# EAGLE board FV1 DSP pedal (EAGLE 9.3.0)
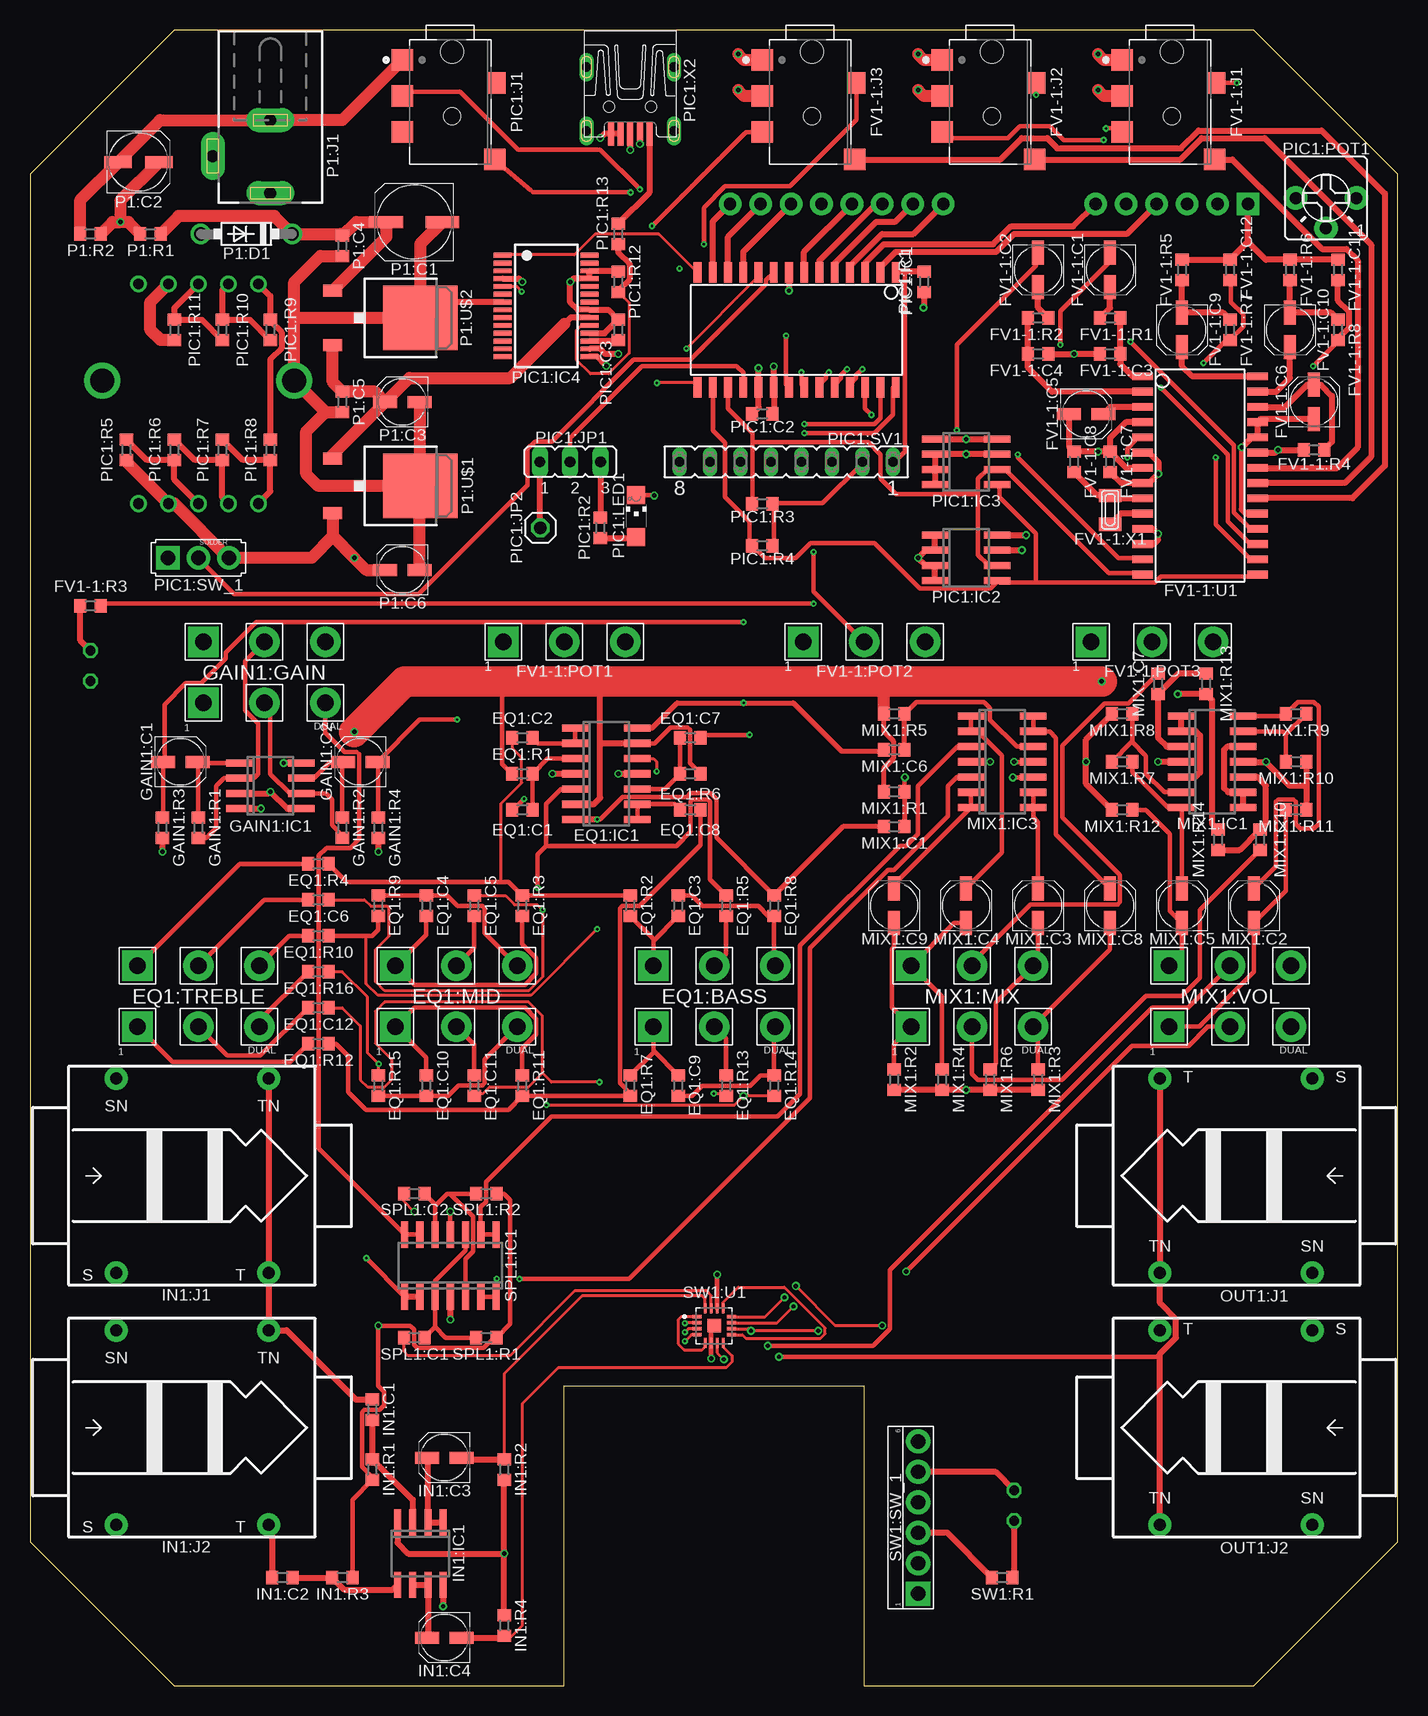
[diagram p11: board, top side]
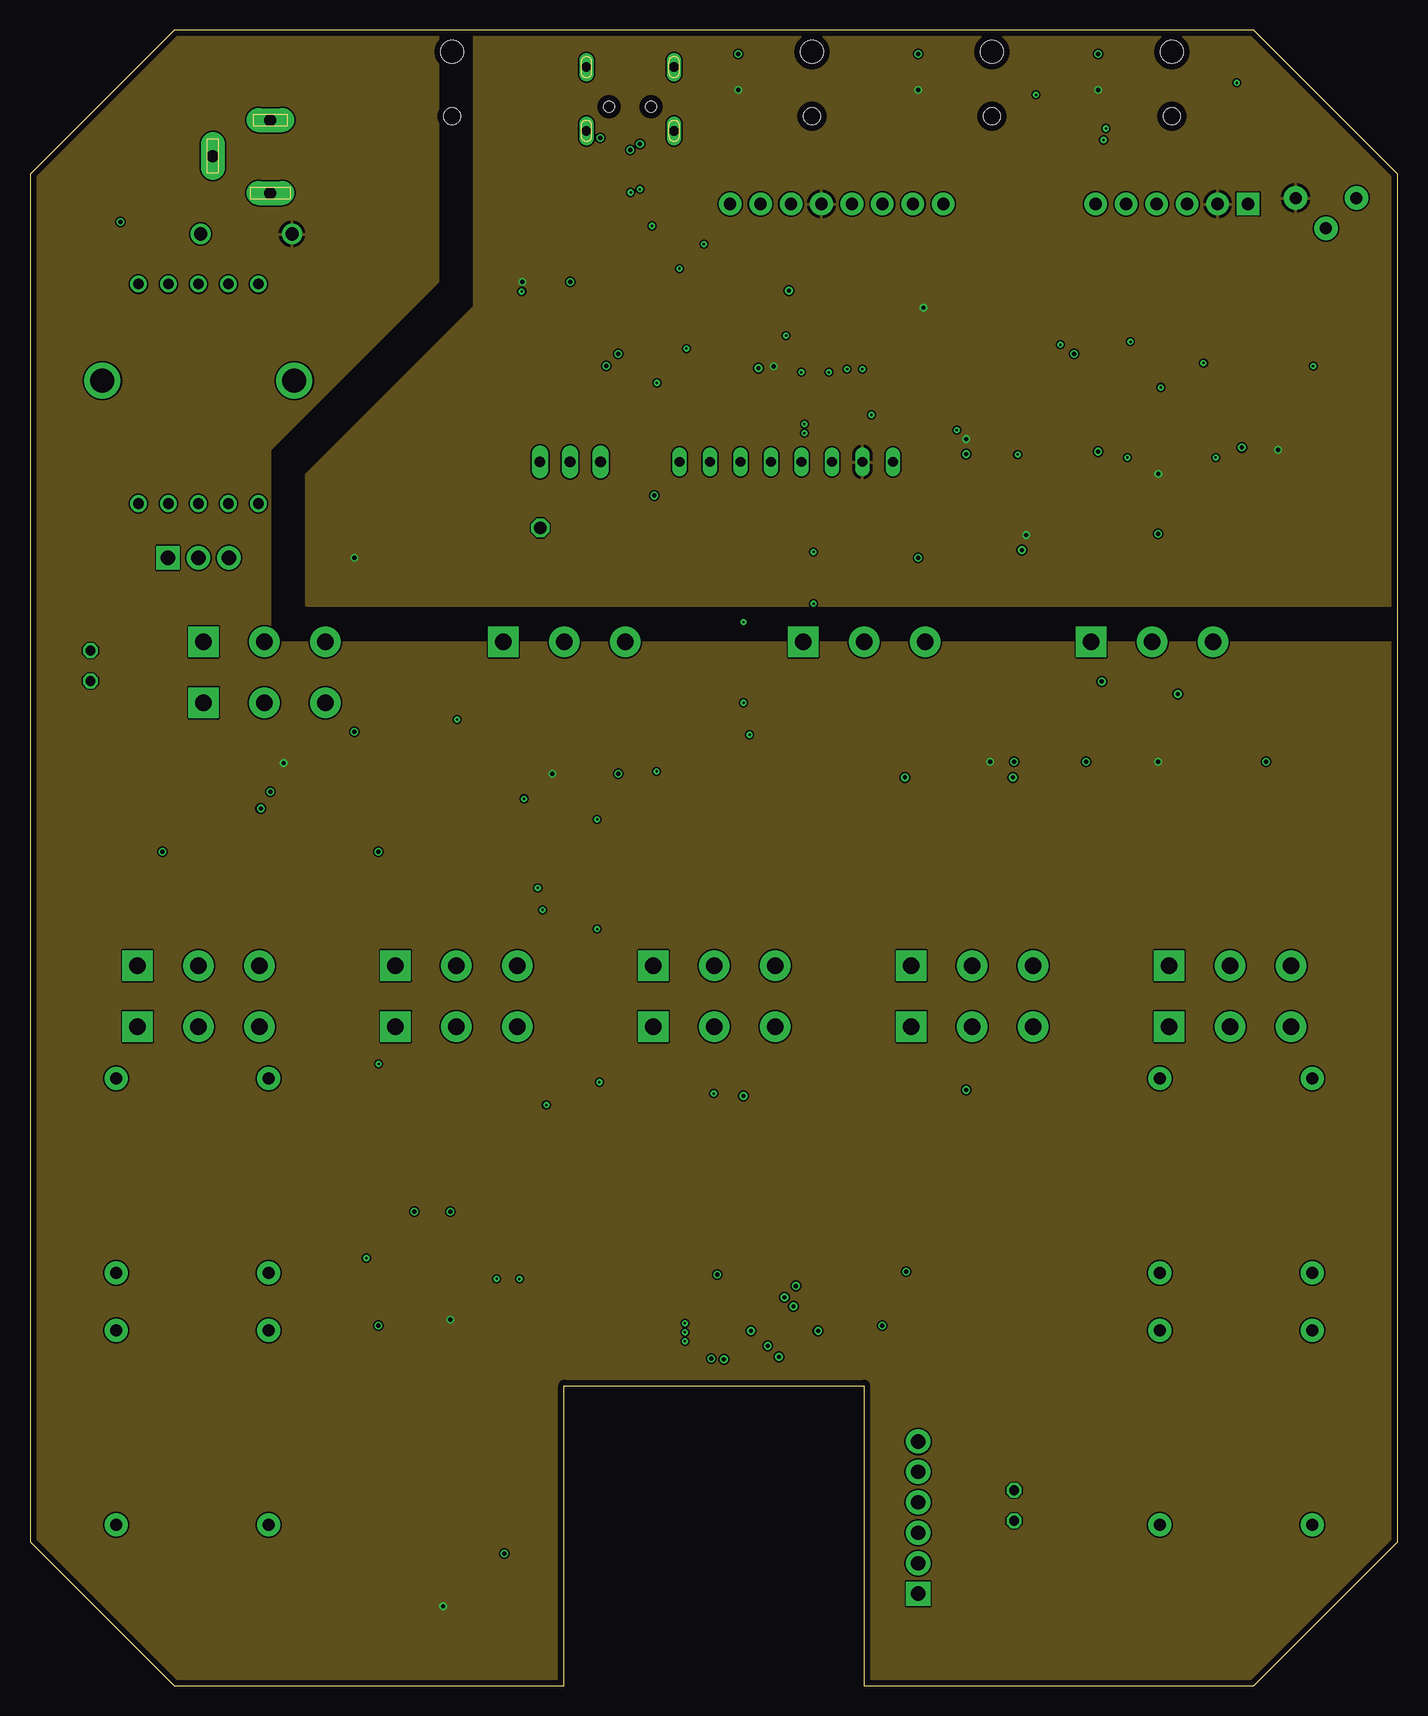
[diagram p12: board, inner layer Route2]
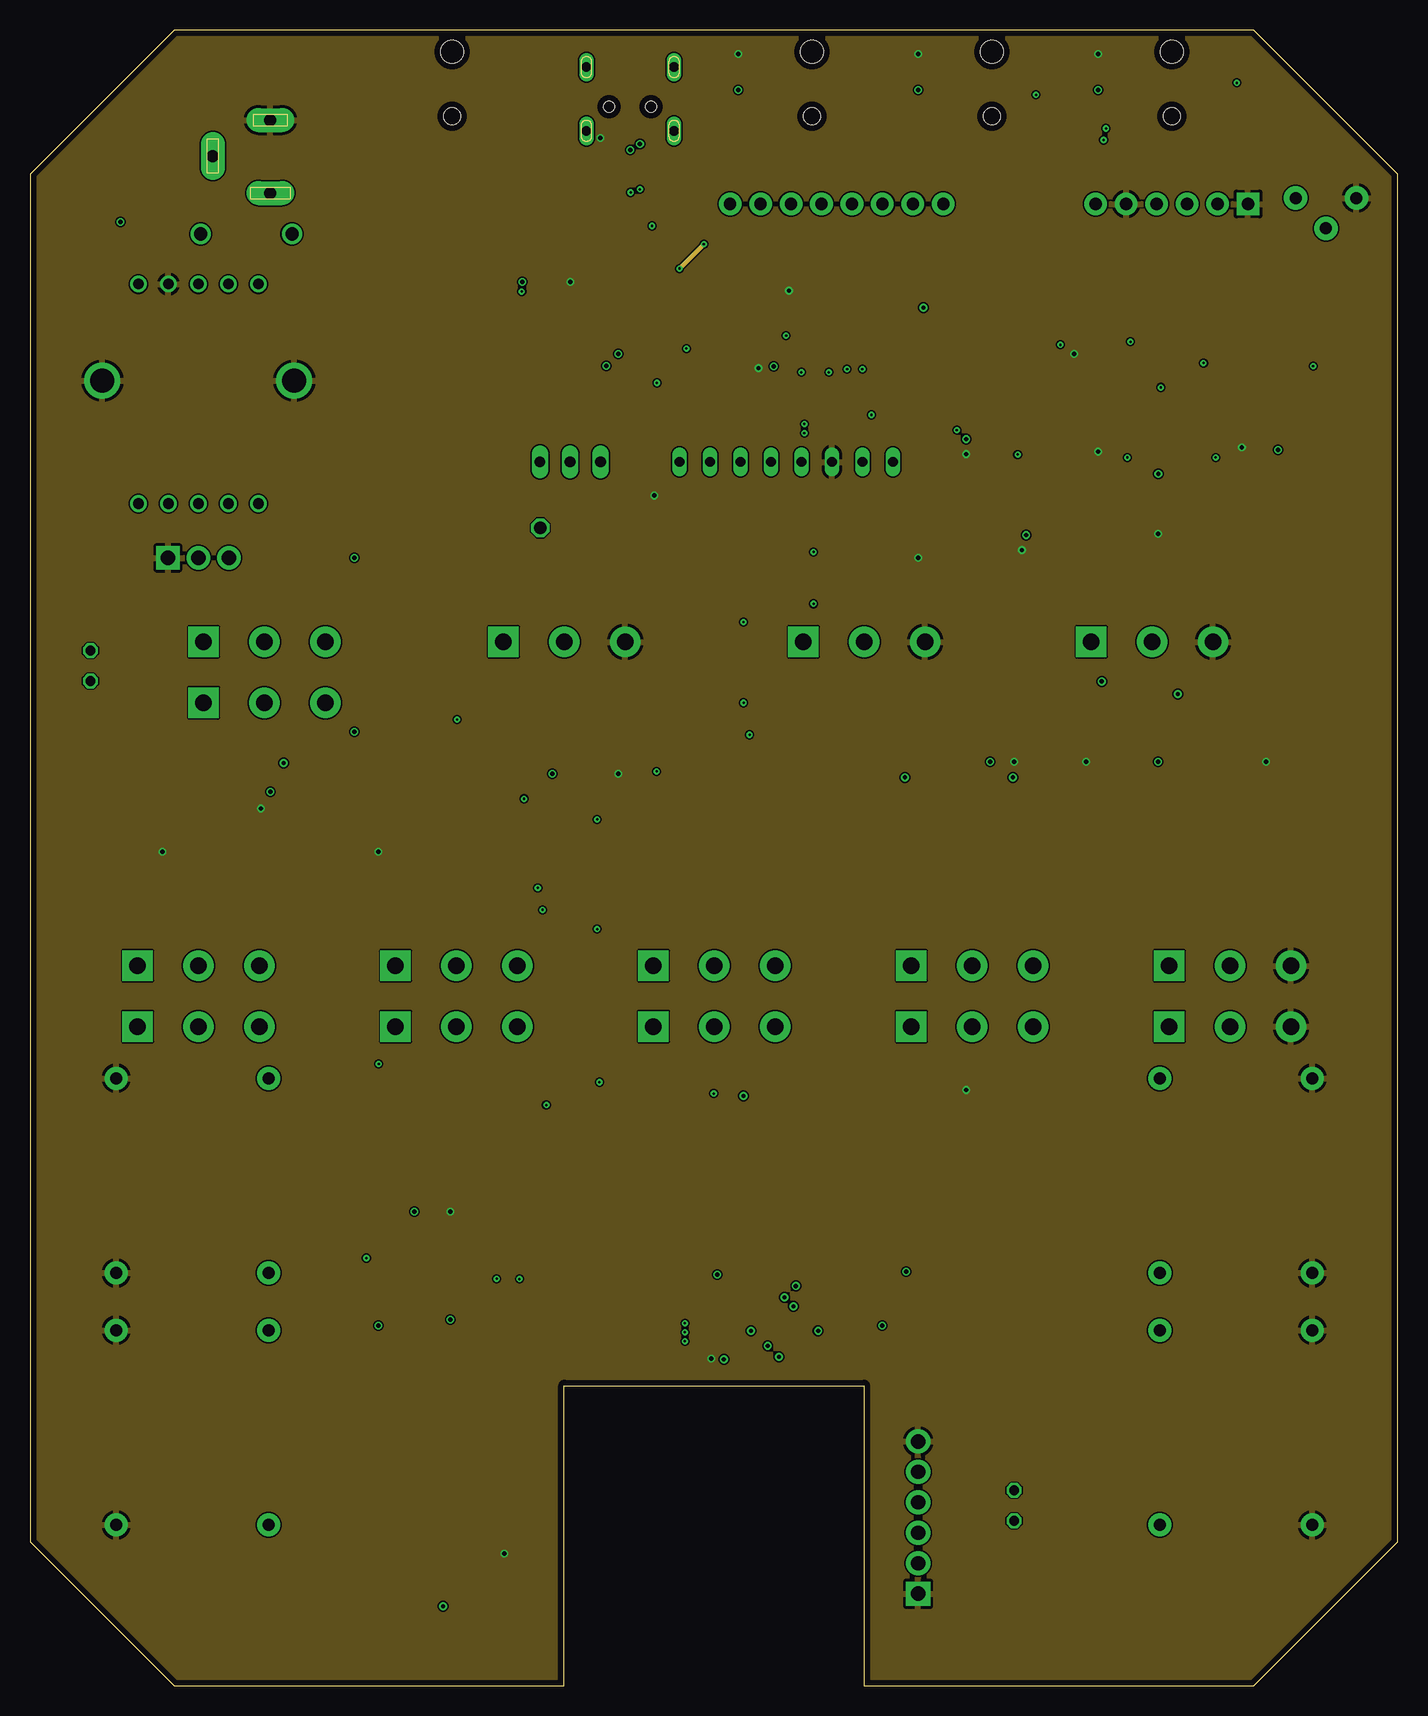
[diagram p13: board, inner layer Route15]
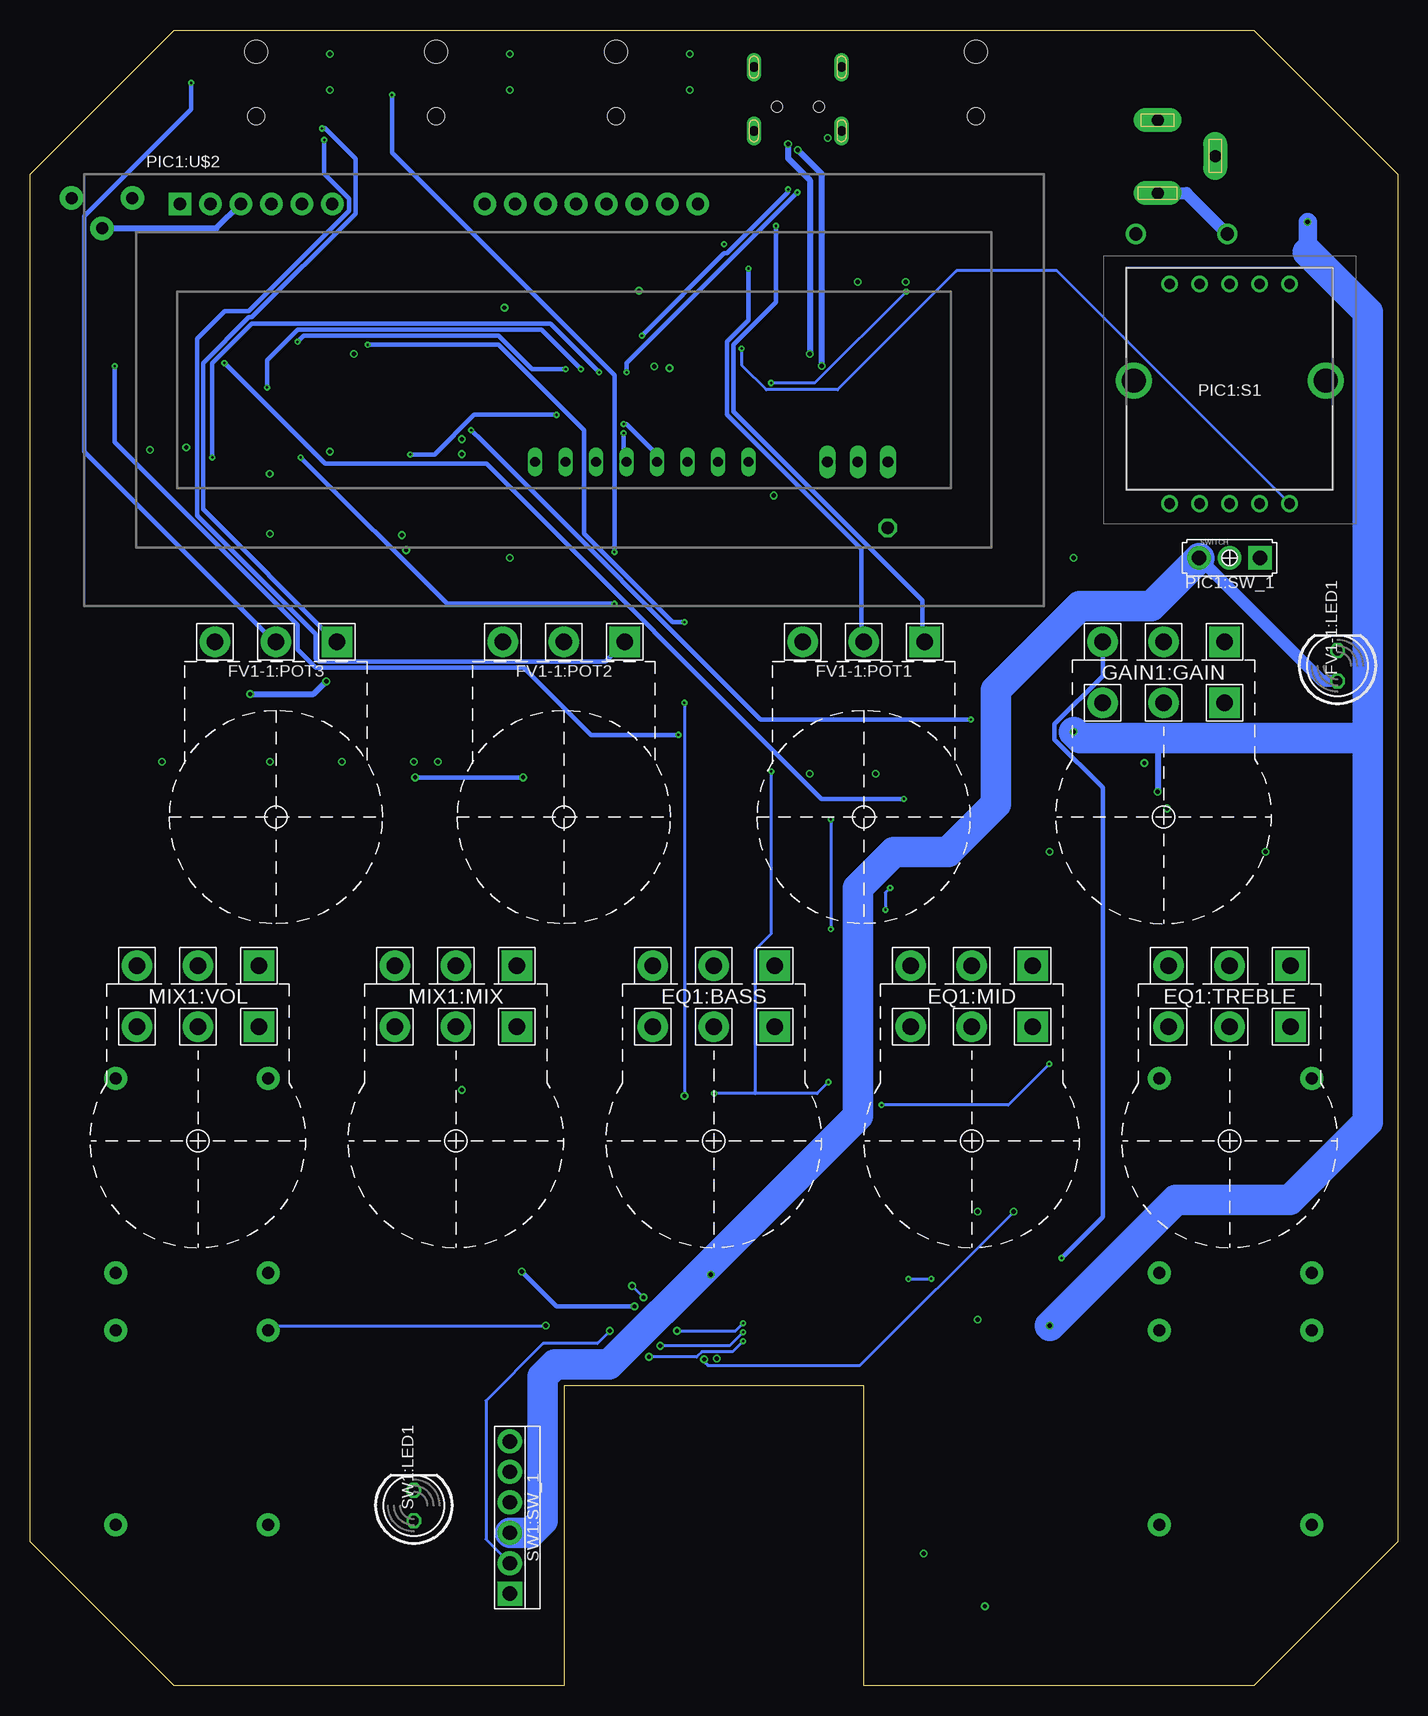
[diagram p14: board, bottom side, seen from below]

Size 114 x 138 mm. Coordinates in mm from the lower left corner, seen from the top.
Outline: 0,12 12,0 44.5,0 44.5,25 69.5,25 69.5,0 102,0 114,12 114,126 102,138 12,138 0,126 0,12
Copper layers (1*2*15*16): Top 0.035mm / dielectric 0.4mm / Route2 0.035mm / dielectric 0.65mm / Route15 0.035mm / dielectric 0.4mm / Bottom 0.035mm
Design rules "custom4layer": minimum track width 10mil, minimum drill 0.2mm, track to track 5mil, track to pad 5mil, pad to pad 5mil, via to via 5mil, smd to smd 0mil, copper to edge 20mil, drill to drill 10mil, minimum pad ring 6mil, minimum via ring 6mil, stop-mask expansion 0mil, vias tented up to drill 100mil, thermal gap 10mil

## Footprints (pad centres in the part's own frame; a part is rotated, then mirrored left to right if it is on the bottom)
16MM_DUALGANG = drill 1.4 pad 2.54 square: 1 5.08,0; 4 5.08,5.08 | drill 1.4 pad 2.54: 2 0,0; 3 -5.08,0; 5 0,5.08; 6 -5.08,5.08
RESISTOR_R0603 = smd 1 x 1.1: 1 -0.85,0; 2 0.85,0
SO14 = smd 0.6 x 2.2: 1 -3.81,-2.6; 2 -2.54,-2.6; 3 -1.27,-2.6; 4 0,-2.6; 5 1.27,-2.6; 6 2.54,-2.6; 7 3.81,-2.6; 8 3.81,2.6; 9 2.54,2.6; 10 1.27,2.6; 11 0,2.6; 12 -1.27,2.6; 13 -2.54,2.6; 14 -3.81,2.6
UD-4X5,8_NICHICON = smd 2 x 1: + 1.425,0; - -1.425,0
CUI_SJ2-25313D-SMT-TR = smd 1.8 x 1.8: 1 -2,-4; 2 6.3,3.7; 3 1,-4; 11 4,-4 | smd 1.8 x 1.5: 10 -0.1,3.85 | hole 1.9: -2.7,0.15 | hole 1.4: 2.7,0.15
LED5MM = drill 0.813 octagon: A -1.27,0; K 1.27,0
16MM_B.MOUNT = drill 1.4 pad 2.54 square: 1 5.08,0 | drill 1.4 pad 2.54: 2 0,0; 3 -5.08,0
SO28W = smd 0.65 x 1.7: 1 -7.62,-4.78; 2 -6.35,-4.78; 3 -5.08,-4.78; 4 -3.81,-4.78; 5 -2.54,-4.78; 6 -1.27,-4.78; 7 0,-4.78; 8 1.27,-4.78; 9 2.54,-4.78; 10 3.81,-4.78; 11 5.08,-4.78; 12 6.35,-4.78; 13 7.62,-4.78; 14 8.89,-4.78; 15 8.89,4.78; 16 7.62,4.78; 17 6.35,4.78; 18 5.08,4.78; 19 3.81,4.78; 20 2.54,4.78; 21 1.27,4.78; 22 0,4.78; 23 -1.27,4.78; 24 -2.54,4.78; 25 -3.81,4.78; 26 -5.08,4.78; 27 -6.35,4.78; 28 -7.62,4.78
XTAL3215 = smd 1.1 x 1.9: P$1 1.2,0; P$2 -1.2,0
SO08 = smd 0.6 x 2.2: 1 -1.905,-2.6; 2 -0.635,-2.6; 3 0.635,-2.6; 4 1.905,-2.6; 5 1.905,2.6; 6 0.635,2.6; 7 -0.635,2.6; 8 -1.905,2.6
TS_SW = drill 1 pad 1.93: S 6.35,8.115; SN 6.35,-8.115; T -6.35,8.115; TN -6.35,-8.115
UD-6,3X5,8_NICHICON = smd 2.8 x 1: + 2.35,0; - -2.35,0
UD-5X5,8_NICHICON = smd 2.3 x 1: + 1.725,0; - -1.7,0
DO41-7.6 = drill 1.1 pad 1.7: A 3.81,0; C -3.81,0
DCJ0202 = drill 1 pad 2 long: 1 0,3.1; 2 4.8,0; 3 0,-3
TO252 = smd 1 x 1.6: 1 -2.28,-4.8; 2 2.28,-4.8 | smd 5.4 x 6.2: 3 0,2.5
SO-08 = smd 0.6 x 2.2: 1 -1.905,-2.6; 2 -0.635,-2.6; 3 0.635,-2.6; 4 1.905,-2.6; 5 1.905,2.6; 6 0.635,2.6; 7 -0.635,2.6; 8 -1.905,2.6
SSOP28 = smd 0.4 x 1.5: 1 -4.225,-3.625; 2 -3.575,-3.625; 3 -2.925,-3.625; 4 -2.275,-3.625; 5 -1.625,-3.625; 6 -0.975,-3.625; 7 -0.325,-3.625; 8 0.325,-3.625; 9 0.975,-3.625; 10 1.625,-3.625; 11 2.275,-3.625; 12 2.925,-3.625; 13 3.575,-3.625; 14 4.225,-3.625; 15 4.225,3.625; 16 3.575,3.625; 17 2.925,3.625; 18 2.275,3.625; 19 1.625,3.625; 20 0.975,3.625; 21 0.325,3.625; 22 -0.325,3.625; 23 -0.975,3.625; 24 -1.625,3.625; 25 -2.275,3.625; 26 -2.925,3.625; 27 -3.575,3.625; 28 -4.225,3.625
JP2 = drill 0.914 long: 1 -2.54,0; 2 0,0; 3 2.54,0
1X01 = drill 1.016 octagon: 1 0,0
CHIPLED_1206 = smd 1.5 x 1.5: A 0,-1.75; C 0,1.75
TRIM1 = drill 1 pad 1.93: 1 -2.54,0; 2 0,2.54; 3 2.54,0
SR1712F010820F0AN9N027 = drill 0.9 pad 1.4: 1 5,-9.475; 2 2.5,-9.475; 3 0,-9.475; 4 -2.5,-9.475; 5 -5,-9.475; 6 -5,8.825; 7 -2.5,8.825; 8 0,8.825; 9 2.5,8.825; 10 5,8.825 | drill 2 pad 3: MH1 -8,0.775; MH2 8,0.775
FE08 = drill 0.813 long: 1 -8.89,0; 2 -6.35,0; 3 -3.81,0; 4 -1.27,0; 5 1.27,0; 6 3.81,0; 7 6.35,0; 8 8.89,0
SPDT.MINI = drill 1.2 pad 1.93 square: 1 0,2.54 | drill 1.2 pad 1.93: 2 0,0; 3 0,-2.54
LCD16X2RGB = drill 1.016 pad 1.88 square: 1 -32,15.5 | drill 1.016 pad 1.88: 2 -29.46,15.5; 3 -26.92,15.5; 4 -24.38,15.5; 5 -21.84,15.5; 6 -19.3,15.5; 11 -6.6,15.5; 12 -4.06,15.5; 13 -1.52,15.5; 14 1.02,15.5; 15 3.56,15.5; 16 6.1,15.5; 17 8.64,15.5; 18 11.18,15.5
UX60-MB-5S8 = smd 2 x 0.5: 1 8.65,1.6; 2 8.65,0.8; 3 8.65,0; 4 8.65,-0.8; 5 8.65,-1.6 | drill 0.8 long: M1 3.1,-3.65; M2 3.1,3.65; M3 8.4,3.65; M4 8.4,-3.65 | hole 0.9: 6.4,-1.75; 6.4,1.75
DPDT.WIRE = drill 1.2 pad 2.032 square: A1 -6.35,0 | drill 1.2 pad 2.032: A2 -3.81,0; A3 -1.27,0; B1 1.27,0; B2 3.81,0; B3 6.35,0
QFN50P300X300X80-17N = smd 0.84 x 0.27: 1 -1.435,0.75; 2 -1.435,0.25; 3 -1.435,-0.25; 4 -1.435,-0.75; 9 1.435,-0.75; 10 1.435,-0.25; 11 1.435,0.25; 12 1.435,0.75 | smd 0.27 x 0.84: 5 -0.75,-1.435; 6 -0.25,-1.435; 7 0.25,-1.435; 8 0.75,-1.435; 13 0.75,1.435; 14 0.25,1.435; 15 -0.25,1.435; 16 -0.75,1.435 | smd 1.1 x 1.1: 17 0,0

## Placement (x,y rotation side)
EQ1:BASS  B100k  [16MM_DUALGANG]  57,60 180 top
EQ1:C1  220n  [RESISTOR_R0603]  41,73 180 top
EQ1:C2  1u  [RESISTOR_R0603]  41,79 0 top
EQ1:C3  50n  [RESISTOR_R0603]  54,65 270 top
EQ1:C4  5n  [RESISTOR_R0603]  33,65 270 top
EQ1:C5  22n  [RESISTOR_R0603]  37,65 270 top
EQ1:C6  5n  [RESISTOR_R0603]  24,65.5 180 top
EQ1:C7  220n  [RESISTOR_R0603]  55,79 0 top
EQ1:C8  1u  [RESISTOR_R0603]  55,73 180 top
EQ1:C9  50n  [RESISTOR_R0603]  54,50 90 top
EQ1:C10  5n  [RESISTOR_R0603]  33,50 90 top
EQ1:C11  22n  [RESISTOR_R0603]  37,50 90 top
EQ1:C12  5n  [RESISTOR_R0603]  24,56.5 180 top
EQ1:IC1  TL074D  [SO14]  48,76 270 top
EQ1:MID  B100k  [16MM_DUALGANG]  35.5,60 180 top
EQ1:R1  1M  [RESISTOR_R0603]  41,76 0 top
EQ1:R2  11k  [RESISTOR_R0603]  50,65 90 top
EQ1:R3  3.6k  [RESISTOR_R0603]  41,65 90 top
EQ1:R4  1.8k  [RESISTOR_R0603]  24,68.5 0 top
EQ1:R5  11k  [RESISTOR_R0603]  58,65 90 top
EQ1:R6  1M  [RESISTOR_R0603]  55,76 180 top
EQ1:R7  11k  [RESISTOR_R0603]  50,50 270 top
EQ1:R8  11k  [RESISTOR_R0603]  62,65 270 top
EQ1:R9  3.6k  [RESISTOR_R0603]  29,65 90 top
EQ1:R10  1.8k  [RESISTOR_R0603]  24,62.5 180 top
EQ1:R11  3.6k  [RESISTOR_R0603]  41,50 270 top
EQ1:R12  1.8k  [RESISTOR_R0603]  24,53.5 0 top
EQ1:R13  11k  [RESISTOR_R0603]  58,50 270 top
EQ1:R14  11k  [RESISTOR_R0603]  62,50 90 top
EQ1:R15  3.6k  [RESISTOR_R0603]  29,50 270 top
EQ1:R16  1.8k  [RESISTOR_R0603]  24,59.5 180 top
EQ1:TREBLE  B500k  [16MM_DUALGANG]  14,60 180 top
FV1-1:C1  1u  [UD-4X5,8_NICHICON]  90,118 270 top
FV1-1:C2  1u  [UD-4X5,8_NICHICON]  84,118 270 top
FV1-1:C3  1n  [RESISTOR_R0603]  90,111 0 top
FV1-1:C4  1n  [RESISTOR_R0603]  84,111 180 top
FV1-1:C5  1u  [UD-4X5,8_NICHICON]  88,106 0 top
FV1-1:C6  1u  [UD-4X5,8_NICHICON]  107,107 90 top
FV1-1:C7  100n  [RESISTOR_R0603]  90,102 270 top
FV1-1:C8  15p  [RESISTOR_R0603]  87,102 270 top
FV1-1:C9  3.3u  [UD-4X5,8_NICHICON]  96,113 270 top
FV1-1:C10  3.3u  [UD-4X5,8_NICHICON]  105,113 270 top
FV1-1:C11  2.2n  [RESISTOR_R0603]  109,118 270 top
FV1-1:C12  2.2n  [RESISTOR_R0603]  100,118 270 top
FV1-1:J1  SJ2-25313D-SMT-TR  [CUI_SJ2-25313D-SMT-TR]  95,133.5 270 top
FV1-1:J2  SJ2-25313D-SMT-TR  [CUI_SJ2-25313D-SMT-TR]  80,133.5 270 top
FV1-1:J3  SJ2-25313D-SMT-TR  [CUI_SJ2-25313D-SMT-TR]  65,133.5 270 top
FV1-1:LED1  [LED5MM]  5,85 90 bottom
FV1-1:POT1  B10k  [16MM_B.MOUNT]  44.5,87 180 top
FV1-1:POT2  B10k  [16MM_B.MOUNT]  69.5,87 180 top
FV1-1:POT3  B10k  [16MM_B.MOUNT]  93.5,87 180 top
FV1-1:R1  1k  [RESISTOR_R0603]  90,114 0 top
FV1-1:R2  1k  [RESISTOR_R0603]  84,114 180 top
FV1-1:R3  100  [RESISTOR_R0603]  5,90 0 top
FV1-1:R4  100  [RESISTOR_R0603]  107,103 180 top
FV1-1:R5  10k  [RESISTOR_R0603]  96,118 270 top
FV1-1:R6  10k  [RESISTOR_R0603]  105,118 270 top
FV1-1:R7  1k  [RESISTOR_R0603]  100,113 270 top
FV1-1:R8  1k  [RESISTOR_R0603]  109,113 270 top
FV1-1:U1  [SO28W]  97.5,101.5 270 top
FV1-1:X1  FC-135  [XTAL3215]  90,98 270 top
GAIN1:C1  10u  [UD-4X5,8_NICHICON]  12.5,77 0 top
GAIN1:C2  10u  [UD-4X5,8_NICHICON]  27.5,77 180 top
GAIN1:GAIN  A50k  [16MM_DUALGANG]  19.5,87 180 top
GAIN1:IC1  TL072D  [SO08]  20,75 270 top
GAIN1:R1  33.3k  [RESISTOR_R0603]  14,71.5 90 top
GAIN1:R2  33.3K  [RESISTOR_R0603]  26,71.5 90 top
GAIN1:R3  1M  [RESISTOR_R0603]  11,71.5 90 top
GAIN1:R4  1M  [RESISTOR_R0603]  29,71.5 90 top
IN1:C1  220n  [RESISTOR_R0603]  28.5,23 90 top
IN1:C2  220n  [RESISTOR_R0603]  21,9 180 top
IN1:C3  10u  [UD-4X5,8_NICHICON]  34.5,19 180 top
IN1:C4  10u  [UD-4X5,8_NICHICON]  34.5,4 180 top
IN1:IC1  TL072D  [SO08]  32.5,11 180 top
IN1:J1  SWITCHED_MONO_JACK  [TS_SW]  13.5,42.5 180 top
IN1:J2  SWITCHED_MONO_JACK  [TS_SW]  13.5,21.5 180 top
IN1:R1  1M  [RESISTOR_R0603]  28.5,18 270 top
IN1:R2  1M  [RESISTOR_R0603]  39.5,18 90 top
IN1:R3  1M  [RESISTOR_R0603]  26,9 0 top
IN1:R4  1M  [RESISTOR_R0603]  39.5,5 270 top
MIX1:C1  220n  [RESISTOR_R0603]  72,71.6 180 top
MIX1:C2  10u  [UD-4X5,8_NICHICON]  102,65 90 top
MIX1:C3  10u  [UD-4X5,8_NICHICON]  84,65 90 top
MIX1:C4  10u  [UD-4X5,8_NICHICON]  78,65 90 top
MIX1:C5  10u  [UD-4X5,8_NICHICON]  96,65 90 top
MIX1:C6  220n  [RESISTOR_R0603]  72,78 180 top
MIX1:C7  220n  [RESISTOR_R0603]  94,83.5 90 top
MIX1:C8  10u  [UD-4X5,8_NICHICON]  90,65 90 top
MIX1:C9  10u  [UD-4X5,8_NICHICON]  72,65 90 top
MIX1:C10  220n  [RESISTOR_R0603]  102.5,70.5 270 top
MIX1:IC1  TL074D  [SO14]  98.5,77 270 top
MIX1:IC3  TL074D  [SO14]  81,77 270 top
MIX1:MIX  B50k  [16MM_DUALGANG]  78.5,60 180 top
MIX1:R1  1M  [RESISTOR_R0603]  72,74.5 180 top
MIX1:R2  1M  [RESISTOR_R0603]  72,50.5 270 top
MIX1:R3  1M  [RESISTOR_R0603]  84,50.5 270 top
MIX1:R4  1M  [RESISTOR_R0603]  76,50.5 270 top
MIX1:R5  1M  [RESISTOR_R0603]  72,81 0 top
MIX1:R6  1M  [RESISTOR_R0603]  80,50.5 270 top
MIX1:R7  200  [RESISTOR_R0603]  91,77 0 top
MIX1:R8  100  [RESISTOR_R0603]  91,81 180 top
MIX1:R9  200  [RESISTOR_R0603]  105.5,81 180 top
MIX1:R10  100  [RESISTOR_R0603]  105.5,77 0 top
MIX1:R11  1M  [RESISTOR_R0603]  105.5,73 0 top
MIX1:R12  1M  [RESISTOR_R0603]  91,73 180 top
MIX1:R13  1M  [RESISTOR_R0603]  98,83.5 270 top
MIX1:R14  1M  [RESISTOR_R0603]  99,70.5 90 top
MIX1:VOL  A50k  [16MM_DUALGANG]  100,60 180 top
OUT1:J1  SWITCHED_MONO_JACK  [TS_SW]  100.5,42.5 0 top
OUT1:J2  SWITCHED_MONO_JACK  [TS_SW]  100.5,21.5 0 top
P1:C1  47u  [UD-6,3X5,8_NICHICON]  32,122 180 top
P1:C2  22u  [UD-5X5,8_NICHICON]  9,127 0 top
P1:C3  2.2u  [UD-4X5,8_NICHICON]  31,107 180 top
P1:C4  100n  [RESISTOR_R0603]  26,120 270 top
P1:C5  100n  [RESISTOR_R0603]  26,107 270 top
P1:C6  2.2u  [UD-4X5,8_NICHICON]  31,93 180 top
P1:D1  1N5817-B  [DO41-7.6]  18,121 180 top
P1:J1  DCJ0202  [DCJ0202]  20,127.5 180 top
P1:R1  33k  [RESISTOR_R0603]  10,121 0 top
P1:R2  33k  [RESISTOR_R0603]  5,121 0 top
P1:U$1  LF33ABDT-TR  [TO252]  30,100 270 top
P1:U$2  LF50ABDT-TR  [TO252]  30,114 270 top
PIC1:C2  100n  [RESISTOR_R0603]  61,106 180 top
PIC1:C3  100n  [RESISTOR_R0603]  49,113 90 top
PIC1:IC1  PIC16LF1516/18SO  [SO28W]  64.5,113 180 top
PIC1:IC2  24LC32ASN  [SO-08]  78,94 270 top
PIC1:IC3  24LC32ASN  [SO-08]  78,102 270 top
PIC1:IC4  FT232RL  [SSOP28]  43,115 270 top
PIC1:J1  SJ2-25313D-SMT-TR  [CUI_SJ2-25313D-SMT-TR]  35,133.5 270 top
PIC1:JP1  [JP2]  45,102 0 top
PIC1:JP2  [1X01]  42.5,96.5 0 top
PIC1:LED1  [CHIPLED_1206]  50.5,97.5 0 top
PIC1:POT1  [TRIM1]  108,124 180 top
PIC1:R1  50k  [RESISTOR_R0603]  74.5,117 90 top
PIC1:R2  100  [RESISTOR_R0603]  47.5,96.5 90 top
PIC1:R3  10k  [RESISTOR_R0603]  61,98.5 0 top
PIC1:R4  10k  [RESISTOR_R0603]  61,95 180 top
PIC1:R5  10k  [RESISTOR_R0603]  8,103 90 top
PIC1:R6  10k  [RESISTOR_R0603]  12,103 90 top
PIC1:R7  10k  [RESISTOR_R0603]  16,103 90 top
PIC1:R8  10k  [RESISTOR_R0603]  20,103 90 top
PIC1:R9  10k  [RESISTOR_R0603]  20,113 270 top
PIC1:R10  10k  [RESISTOR_R0603]  16,113 270 top
PIC1:R11  10k  [RESISTOR_R0603]  12,113 270 top
PIC1:R12  10k  [RESISTOR_R0603]  49,117 90 top
PIC1:R13  4k7  [RESISTOR_R0603]  49,121 270 top
PIC1:S1  SR1712F-0108-20F0A-N9-N-027  [SR1712F010820F0AN9N027]  14,108 0 bottom
PIC1:SV1  [FE08]  63,102 180 top
PIC1:SW_1  [SPDT.MINI]  14,94 90 top
PIC1:U$2  [LCD16X2RGB]  69.5,108 0 bottom
PIC1:X2  MINI-USB-UX60-MB-5S8  [UX60-MB-5S8]  50,138 270 top
SPL1:C1  220n  [RESISTOR_R0603]  32,29 180 top
SPL1:C2  220n  [RESISTOR_R0603]  32,41 180 top
SPL1:IC1  TL074D  [SO14]  35,35 0 top
SPL1:R1  1M  [RESISTOR_R0603]  38,29 0 top
SPL1:R2  1M  [RESISTOR_R0603]  38,41 0 top
SW1:LED1  [LED5MM]  82,15 90 bottom
SW1:R1  100  [RESISTOR_R0603]  81,9 0 top
SW1:SW_1  [DPDT.WIRE]  74,14 90 top
SW1:U1  MAX4910ETET  [QFN50P300X300X80-17N]  57,30 0 top

## Tracks (layer width: path | path; a pad name or v marks a point on that pad's centre or on a via)
3.3V  (via drill 0.35)
  Top 0.254: 93.85,100.85 93.92,100.78 v94.02,101
  Top 0.381: v57.25,34.25 SW1:U1.14 | PIC1:R4.1 61.98,95.25 61.98,98.3 PIC1:R3.2 61.98,98.55 66.04,98.55 69.34,101.85 PIC1:SV1.2
  Top 0.508: PIC1:C2.1 61.96,106.11 PIC1:IC1.20 v61.96,109.96 | PIC1:IC4.4 40.73,117.28 v41,117 | FV1-1:C7.2 90.92,100.23 FV1-1:U1.8 93.23,100.23 93.85,100.85 94,101 | FV1-1:U1.6 93.23,102.77 94.02,101.98 v94.02,101 | 105.92,102.77 FV1-1:R4.2 v104,103 103.77,102.77 FV1-1:U1.23 | PIC1:IC3.1 v78,103.91 PIC1:IC3.8 | PIC1:IC2.8 v83,95.91 | PIC1:R1.1 74.5,114.9 v74.45,114.85 | SW1:R1.1 76.42,12.73 SW1:SW_1.A3
  Top 1.016: P1:U$1.2 25.2,95.8 | 25.2,95.8 v27,94 28,93 P1:C6.+ | 25.2,95.8 23.4,94 PIC1:SW_1.3 12.02,98.53 PIC1:S1.2 8,102.03 PIC1:R5.1 | FV1-1:J3.3 59.5,132.5 v59,133 | FV1-1:J2.3 74.5,132.5 v74,133 | FV1-1:J1.3 89.5,132.5 v89,133
  Bottom 0.254: 57,35.5 57.25,35.25 v57.25,34.25
  Bottom 1.016: PIC1:SW_1.3 6.27,83.73 FV1-1:LED1.A
  Bottom 2.54: PIC1:SW_1.3 20.54,90 26.5,90 33.5,83 33.5,73.5 37.5,69.5 42,69.5 45,66.5 45,47.5 57,35.5 65.72,26.78 70.24,26.78 71.28,25.74 71.28,13.72 72.27,12.73 SW1:SW_1.A3
  pour Route2: 114,90 23,90 23,101 37,115 37,138 102,138 114,126
4.5V  (via drill 0.35)
  Top 0.381: IN1:R3.2 26.85,15.5 IN1:R1.2 28.5,17.35 27.63,18.22 27.63,22.78 27.82,22.97 29.12,22.97 29.5,23.35 29.5,24.5 29,25 v29,30 31.65,30 31.97,29.68 31.97,28.38 32.22,28.13 37.78,28.13 38.65,29 SPL1:R1.2 40,30.15 40,40.5 39.5,41 SPL1:R2.2 | EQ1:R6.1 54.97,76.88 54.97,79.68 54.78,79.87 53.37,79.87 52.04,78.54 EQ1:IC1.13 | EQ1:R1.1 39.33,76.83 39.33,83.53 39.5,83.7
  Top 0.406: MIX1:R1.2 71.15,76.48 71.98,77.31 71.98,78.69 71.15,79.52 MIX1:R5.1
  Top 0.508: EQ1:IC1.6 46.96,73.46 47.5,74 47.5,78.5 | 47.5,78.5 47.5,83.7 | EQ1:IC1.13 47.54,78.54 47.5,78.5 | GAIN1:IC1.5 21.41,73.09 v20,74.5 19.86,74.36 GAIN1:IC1.3 | MIX1:R14.2 98.5,71.85 98.5,82.15 MIX1:R13.2 v95.65,82.65
  Top 1.016: P1:C2.+ 7.5,123.78 v7.5,122 | P1:R1.1 8.15,122 v7.5,122 | P1:R2.2 6.85,122 v7.5,122 | MIX1:R5.1 71.15,83.55 71,83.7
  Top 2.54: v27,79.5 31.2,83.7 39.5,83.7 47.5,83.7 71,83.7 v89.3,83.7
  Bottom 0.508: 20,79 v20,74.5 | v95.65,82.65 90.35,82.65 v89.3,83.7
  Bottom 1.524: v7.5,122 7.5,119.5
  Bottom 2.54: 7.5,119.5 2.5,114.5 2.5,79 | v27,79.5 26.5,79 20,79 2.5,79 | 2.5,79 2.5,47 9,40.5 18.5,40.5 v29,30
9V  (via drill 0.35)
  Top 0.381: MIX1:IC3.4 v80,77
  Top 0.508: IN1:IC1.8 v34.41,6.59 | SPL1:IC1.4 v35,30.5 | GAIN1:IC1.8 v21.09,76.91 | EQ1:IC1.4 v43.5,76 | MIX1:IC1.4 v94,77
  Top 1.016: P1:U$2.1 29.65,120.73 P1:C1.+ 27.15,122 P1:C4.1 25.85,121 P1:D1.C 20.32,122.48 12.34,122.48 P1:R1.2
  pour Route2: 34,138 34,117 23,106 20,103 20,90 20,87 114,87 114,12 102,0 69.5,0 69.5,25 44.5,25 44.5,0 12,0 0,12 0,126 12,138
EQ1:N$1
  Top 0.381: EQ1:C7.1 EQ1:R6.2 52.88,74.73 EQ1:IC1.10
EQ1:N$2
  Top 0.381: EQ1:C2.2 42.31,78.54 EQ1:IC1.2 EQ1:IC1.1
EQ1:N$3
  Top 0.254: 39.24,67 39.24,73.53 40.96,75.25 40.96,77.34 40.2,78.11 40.2,78.87 EQ1:C2.1
  Top 0.381: EQ1:R2.2 EQ1:R3.2 39.85,67 39.24,67 26.35,67 EQ1:R4.2
EQ1:N$4
  Top 0.381: EQ1:R2.1 51.92,62.23 51.92,62.07 | 51.92,62.07 EQ1:BASS.1 | EQ1:C3.2 51.92,62.07
EQ1:N$5
  Top 0.381: EQ1:C4.2 33,62.58 EQ1:MID.1 32.01,58.41 41.24,58.41 42.17,59.34 42.17,60.66 41,61.83 EQ1:R3.1
EQ1:N$6
  Top 0.381: EQ1:TREBLE.1 17.42,68.5 EQ1:R4.1
EQ1:N$7
  Top 0.381: EQ1:MID.3 37.87,62.71 37.87,64.78 37.68,64.97 35.61,64.97 34.73,65.85 EQ1:C4.1 EQ1:R9.2
EQ1:N$8
  Top 0.381: EQ1:R10.2 21.58,62.5 EQ1:TREBLE.3
EQ1:N$9
  Top 0.381: EQ1:C1.1 EQ1:R1.2 43.12,77.27 EQ1:IC1.3
EQ1:N$10
  Top 0.381: EQ1:BASS.3 62,60.08 EQ1:R8.2 61.5,64.15 60.68,64.97 56.03,64.97 55.15,65.85 EQ1:C3.1
EQ1:N$11  (via drill 0.2)
  Top 0.254: EQ1:C6.1 27.84,65.5 28.38,64.96 29.72,64.96 29.91,64.77 29.91,62.48 28.77,61.34 28.77,58.67 29.53,57.91 41.53,57.91 42.67,59.05 42.67,64.63 v42.69,64.65 42.25,65.1 40.34,65.1 39.59,65.85 EQ1:C5.1
  Top 0.381: EQ1:IC1.5 44.23,74.73 43,73.5 43,70 | 43,70 53.85,70 55.03,71.18 55.03,73.68 55.22,73.87 56.48,73.87 56.67,73.68 56.67,67.18 EQ1:R5.2 | v42.29,66.48 42.29,69.29 43,70
  Bottom 0.254: v42.29,66.48 42.69,66.08 v42.69,64.65
EQ1:N$12
  Top 0.381: EQ1:C5.2 37,61.5 EQ1:MID.2
EQ1:N$13
  Top 0.381: EQ1:TREBLE.2 19.5,65.5 EQ1:C6.2
EQ1:N$14
  Top 0.381: EQ1:R5.1 58,61 EQ1:BASS.2
EQ1:N$16
  Top 0.381: EQ1:C8.2 53.69,73.46 EQ1:IC1.9 EQ1:IC1.8
EQ1:N$17
  Top 0.381: EQ1:R12.2 25.5,53.5 26.5,52.5 26.5,49.5 28,48 39.85,48 EQ1:R11.2 EQ1:R7.2 50,49.35 49.13,50.22 49.13,64.78 49.32,64.97 50.77,64.97 55.85,70.05 EQ1:C8.1
EQ1:N$18
  Top 0.381: EQ1:BASS.4 51.92,52.93 | 51.92,52.93 EQ1:C9.2 | EQ1:R7.1 51.92,52.77 51.92,52.93
EQ1:N$19
  Top 0.381: EQ1:C10.2 33,52.34 EQ1:MID.4 32.01,56.51 41.24,56.51 42.17,55.58 42.17,54.26 41,53.09 EQ1:R11.1
EQ1:N$20
  Top 0.381: EQ1:R12.1 21.65,52 11.84,52 EQ1:TREBLE.4
EQ1:N$21
  Top 0.381: EQ1:R15.2 EQ1:C10.1 34.81,49.15 35.69,50.03 37.68,50.03 37.87,50.22 37.87,52.21 EQ1:MID.6
EQ1:N$22
  Top 0.381: EQ1:R16.2 19.08,55.43 EQ1:TREBLE.6
EQ1:N$23
  Top 0.381: EQ1:BASS.6 62,54.84 EQ1:R14.2 60.85,50.85 60,50 56,50 55.15,49.15 EQ1:C9.1
EQ1:N$25  (via drill 0.2)
  Top 0.254: 42.67,51.05 42.67,55.82 41.53,56.96 29.53,56.96 28.77,56.2 28.77,53.53 30.1,52.2 30.1,50.48 29.53,49.91 28.09,49.91 27.5,50.5 27.5,55 26,56.5 EQ1:C12.1 | 42.67,51.05 41.53,49.91 38.29,49.91 37.72,49.34 37.15,49.34 EQ1:C11.1 | v56.96,49.34 57.91,49.34 EQ1:R13.2 | 42.67,51.05 43.43,50.29 v47.43,50.29 | EQ1:IC1.12 51.93,77.27 52.2,77 v52.2,76.2
  Bottom 0.254: 53.53,49.34 48.39,49.34 v47.43,50.29 | 53.53,49.34 v56.96,49.34 | v52.2,76.2 52.2,62.67 53.53,61.34 53.53,49.34
EQ1:N$26
  Top 0.381: EQ1:C11.2 37,53.42 EQ1:MID.5
EQ1:N$27
  Top 0.381: EQ1:TREBLE.5 16.41,52.51 19.16,52.51 EQ1:C12.2
EQ1:N$28
  Top 0.381: EQ1:BASS.5 58,53.92 EQ1:R13.1
FV1-1:N$1  (via drill 0.2)
  Top 0.381: v89.66,129.79 90.9,129.79 FV1-1:J1.11
  Bottom 0.381: v89.66,129.79 89.41,129.79 86.87,127.25 86.87,122.68 95.5,114.05 95.76,114.05 99.57,110.24 99.57,98.04 88.65,87.12 FV1-1:POT3.1
FV1-1:N$2  (via drill 0.2)
  Top 0.381: v100.56,133.59 98.86,133.59 FV1-1:J1.10
  Bottom 0.381: v100.56,133.59 100.56,131.39 109.47,122.47 109.47,102.87 93.73,87.12 FV1-1:POT3.2
FV1-1:N$3
  Top 0.508: FV1-1:J1.2 100.2,127.2 102.58,124.82 102.6,124.82 107.69,119.73 109.71,119.73 110.64,118.8 110.64,103.2 108.94,101.5 FV1-1:U1.22
FV1-1:N$4
  Top 0.508: FV1-1:U1.26 104.58,106.58 106.42,108.42 FV1-1:C6.+ 107.58,108.42 108.5,107.5 108.5,103.65 FV1-1:R4.1
FV1-1:N$5
  Top 0.508: FV1-1:R3.1 4.15,87.12 FV1-1:LED1.K
FV1-1:N$6
  Top 0.508: FV1-1:R1.1 90,114.85 FV1-1:C1.+
FV1-1:N$7  (via drill 0.2)
  Top 0.381: v65.28,90.17 6.1,90.17 FV1-1:R3.2 | v91.44,102.36 91.44,103.12 92.2,103.89 92.71,103.89 FV1-1:U1.5
  Bottom 0.381: v65.28,90.17 79.25,90.17 v91.44,102.36
FV1-1:N$8
  Top 0.508: FV1-1:U1.28 96.88,109.12 96,110 FV1-1:C9.+
FV1-1:N$9
  Top 0.508: FV1-1:R2.1 84,114.85 FV1-1:C2.+
FV1-1:N$10
  Top 0.508: FV1-1:R1.2 FV1-1:C3.2 90.85,110.15 91.88,109.12 FV1-1:U1.1
FV1-1:N$11
  Top 0.508: FV1-1:R2.2 FV1-1:C4.2 83.15,109.85 85.15,107.85 FV1-1:U1.2
FV1-1:N$12
  Top 0.508: FV1-1:U1.3 90,106.58 FV1-1:C5.+
FV1-1:N$13
  Top 0.508: FV1-1:U1.9 90.24,98.96 FV1-1:X1.P$2 88.95,99.2 FV1-1:C8.2
FV1-1:N$14  (via drill 0.2)
  Top 0.381: v83.82,132.59 83.82,133.36 FV1-1:J2.10 | v65.28,94.49 65.28,91.19 69.34,87.12 FV1-1:POT2.2
  Bottom 0.381: v83.82,132.59 83.82,127.76 65.28,109.22 v65.28,94.49
FV1-1:N$15
  Top 0.508: FV1-1:J2.2 95.86,127.2 97.64,128.98 102.88,128.98 111.77,120.09 111.77,102.43 109.57,100.23 FV1-1:U1.21
FV1-1:N$16  (via drill 0.2)
  Top 0.381: FV1-1:J2.11 76.5,129 81.5,129 82.5,130 85,130 86.17,128.83 v89.46,128.83
  Bottom 0.381: v89.46,128.83 89.46,126.04 87.38,123.95 87.38,122.94 95.76,114.55 97.79,114.55 100.08,112.27 100.08,97.54 90.17,87.63 90.17,85.6 89.92,85.34 66.04,85.34 64.52,86.87 FV1-1:POT2.1
FV1-1:N$17  (via drill 0.2)
  Top 0.381: v51.82,121.67 59.65,129.5 FV1-1:J3.11
  Bottom 0.381: v51.82,121.67 51.82,115.32 55.37,111.76 55.37,106.17 39.62,90.42 39.62,87.12 FV1-1:POT1.1
FV1-1:N$18  (via drill 0.2)
  Top 0.381: v56.13,120.14 56.13,123.19 57.91,124.97 63.3,124.97 68.85,130.52 FV1-1:J3.10
  Route15 0.381: v54.1,118.11 v56.13,120.14
  Bottom 0.381: v54.1,118.11 54.1,113.79 55.88,112.01 55.88,105.92 44.7,94.74 44.7,87.12 FV1-1:POT1.2
FV1-1:N$19
  Top 0.508: FV1-1:J3.2 80.86,127.2 82.64,128.98 84.76,128.98 85.6,128.13 95.9,128.13 97.38,129.62 107.65,129.62 112.91,124.36 112.91,101.67 110.19,98.96 FV1-1:U1.20
FV1-1:N$20
  Top 0.508: FV1-1:U1.27 103.85,107.85 105,109 FV1-1:C10.+
FV1-1:N$21
  Top 0.508: FV1-1:U1.10 90.89,97.69 FV1-1:X1.P$1
FV1-1:N$22
  Top 0.508: FV1-1:R5.2 FV1-1:C9.- 99.42,114.42 FV1-1:R7.1
FV1-1:N$23
  Top 0.508: FV1-1:R6.2 FV1-1:C10.- 108.42,114.42 FV1-1:R8.1
GAIN1:N$1
  Top 0.381: GAIN1:C1.+ 14.02,76.91 | 14.02,76.91 GAIN1:IC1.1 | GAIN1:R1.2 14,76.89 14.02,76.91
GAIN1:N$2
  Top 0.381: GAIN1:R2.2 26,76.92 GAIN1:C2.+ 25,77 23.64,75.64 GAIN1:IC1.7
GAIN1:N$3
  Top 0.381: GAIN1:R2.1 26,70.85 25.13,71.72 25.13,73.87 24.64,74.36 GAIN1:IC1.6 21.64,74.36 20,76 20,81.42 GAIN1:GAIN.5
GAIN1:N$4
  Top 0.381: GAIN1:GAIN.2 17.91,85.41 17.91,81.26 19,80.17 19,76 18.64,75.64 GAIN1:IC1.2 16.14,75.64 15.5,75 15.5,71.5 14.65,70.65 GAIN1:R1.1
GND  (via drill 0.35)
  Top 0.254: 56.75,29.75 SW1:U1.17 | 30.66,11.99 30.61,11.92 30.59,11.9
  Top 0.381: MIX1:IC3.11 v82,77 | SPL1:IC1.11 v35,39.5 | v56.75,27.25 SW1:U1.6 56.75,29.75 | v52,99.2 51.95,99.25 PIC1:LED1.C
  Top 0.508: PIC1:R12.2 48.92,117.92 PIC1:IC4.26 PIC1:IC4.25 45.27,117.28 v45,117 45,115.31 45.63,114.67 PIC1:IC4.21 48.17,114.67 PIC1:C3.2 47.88,112.72 PIC1:IC4.18 | PIC1:IC4.7 32.83,115.33 32.5,115 | PIC1:C2.2 60.69,106.54 PIC1:IC1.19 v60.69,109.81 | FV1-1:C6.- 102.55,105.58 FV1-1:U1.25 FV1-1:U1.24 | FV1-1:U1.7 91.35,101.5 FV1-1:C7.1 | FV1-1:U1.4 91.31,105.31 90,104 FV1-1:C7.1 | 101.84,104.04 FV1-1:U1.24 | FV1-1:R5.1 FV1-1:C12.1 101.5,120.35 | 101.5,120.35 PIC1:U$2.1 | FV1-1:C11.1 FV1-1:R6.1 103,118.85 101.5,120.35 | FV1-1:C4.1 v87,111 FV1-1:C3.1 | FV1-1:C5.- 86.58,103.28 FV1-1:C8.1 v89,102.85 FV1-1:C7.1 | FV1-1:U1.24 101.81,104.04 v100.98,103.2 100.98,98.02 101.31,97.69 FV1-1:U1.19 | PIC1:IC2.4 PIC1:IC2.3 74.64,93.36 v74,94 74.64,94.64 PIC1:IC2.2 PIC1:IC2.1 | PIC1:IC3.4 PIC1:IC3.3 PIC1:IC3.2 v78,102.64 PIC1:IC3.7 | PIC1:IC2.7 v82.64,94.64 | PIC1:IC1.8 v63.23,116.27 | IN1:R4.1 v39.5,11 | v39.5,11 IN1:R2.1 | v39.5,11 31.5,11 30.59,11.9 IN1:IC1.4 | GAIN1:IC1.4 v19.2,73.09 | GAIN1:R3.1 v11,69.5 | GAIN1:R4.1 v29,69.5 | EQ1:IC1.11 v49,76 | FV1-1:U1.12 93.65,95.15 94,95.5 v94,96 93.58,96.42 FV1-1:U1.11 | PIC1:X2.4 PIC1:X2.5 47.85,129.35 v47.5,129 | MIX1:R3.2 MIX1:R6.2 v78,49.65 MIX1:R4.2 MIX1:R2.2 | MIX1:IC1.11 v103,77 105,75 106.35,75 | MIX1:R10.2 106.35,75 | 106.35,75 MIX1:R11.2 | MIX1:R12.2 88,75.15 v88,77 88,78.85 MIX1:R8.2
  Top 1.016: FV1-1:J3.1 59.5,135.5 v59,136 | FV1-1:J2.1 74.5,135.5 v74,136 | FV1-1:J1.1 89.5,135.5 v89,136 | P1:R2.1 4.15,123.85 P1:C2.- 10.8,130.5 P1:J1.3 26,130.5 PIC1:J1.1 | PIC1:S1.9 10,115.33 10,113 10.85,112.15 PIC1:R11.2 | 24.62,106.15 PIC1:S1.MH1 22,114 | 24.62,106.15 P1:C5.2 | P1:C3.- 32.42,100.08 | 32.42,100.08 P1:U$1.3 24,100 23,101 23,104.53 24.62,106.15 | 22,114 22,117 24.15,119.15 P1:C4.2 | P1:C1.- 32.5,120.15 32.5,115 P1:U$2.3 22,114 | P1:C6.- 32.42,100.08
  pour Route15: 0,126 0,12 12,0 44,0 44.5,0 44.5,25 69.5,25 69.5,0 102,0 114,12 114,126 102,138 12,138
IN1:N$1
  Top 0.508: IN1:J1.TN IN1:J1.T IN1:J2.TN 21.35,29.61 27.11,23.85 IN1:C1.2
IN1:N$3
  Top 0.508: IN1:C3.+ 33.13,18.94 IN1:IC1.2 IN1:IC1.1
IN1:N$5
  Top 0.508: IN1:C2.1 IN1:R3.1 26.15,8 30.2,8 IN1:IC1.5
IN1:N$6
  Top 0.508: IN1:C1.1 IN1:R1.1 31.86,15.48 IN1:IC1.3
IN1:N$7
  Top 0.508: IN1:IC1.6 IN1:IC1.7 33.13,4.06 IN1:C4.+
IN1:N$8
  Top 0.508: IN1:J2.T 20.15,13.09 IN1:C2.2
MIX1:N$1
  Top 0.381: MIX1:C4.- 77,63.58 MIX1:MIX.1 76,57.42 MIX1:R4.1
MIX1:N$2
  Top 0.508: MIX1:IC1.8 MIX1:IC1.9 99.84,74.46 99.5,74.8 99.5,78 99.77,78.27 MIX1:IC1.12
MIX1:N$3
  Top 0.381: MIX1:R10.1 104.65,79.3 | 104.65,79.3 MIX1:R9.1 | MIX1:IC1.13 104.41,79.54 104.65,79.3
MIX1:N$4
  Top 0.381: MIX1:IC1.14 104.46,80.81 MIX1:R9.2 105.65,82 107,82 107.4,81.6 107.4,71.83 107,71.42 105.86,71.42 105.47,71.82 105.47,73.68 105.28,73.87 104.02,73.87 103.83,73.68 103.83,68.26 MIX1:C2.+
MIX1:N$5
  Top 0.381: MIX1:C3.- 84,60.42 MIX1:MIX.3 80.5,56.92 80.5,51.85 MIX1:R6.1
MIX1:N$6
  Top 0.508: MIX1:R13.1 95.7,84.35 MIX1:C7.1 94,79 94.73,78.27 MIX1:IC1.3
MIX1:N$7
  Top 0.381: MIX1:C4.+ 81,69.42 81,77.52 78.98,79.54 MIX1:IC3.2 MIX1:IC3.1
MIX1:N$8
  Top 0.381: MIX1:IC3.9 MIX1:IC3.8 83.6,72.4 84,72 MIX1:C3.+
MIX1:N$9
  Top 0.508: MIX1:R14.1 100.8,69.65 MIX1:C10.1 103,71.85 103,75 102.27,75.73 MIX1:IC1.10
MIX1:N$10
  Top 0.381: MIX1:C10.2 97.5,64.65 97.5,59 96,57.5 93,57.5 86,50.5 79,50.5 78.5,51 MIX1:MIX.5
MIX1:N$11
  Top 0.381: MIX1:C7.2 91.52,81.87 89.52,81.87 86.01,78.36 86.01,72.37 90.82,67.56 90.82,65.29 90.63,65.11 83.37,65.11 78.5,60.24 MIX1:MIX.2
MIX1:N$13
  Top 0.381: MIX1:C9.- 72,61.57 71.83,61.4 71.83,56.51 MIX1:MIX.4 72,53.5 MIX1:R2.1
MIX1:N$14
  Top 0.381: MIX1:R5.2 73.85,82 79.5,82 80,81.5 80,80.5 82.23,78.27 MIX1:IC3.12
  Top 0.406: MIX1:C6.1 MIX1:R5.2
MIX1:N$15  (via drill 0.35)
  Top 0.381: MIX1:R1.1 72.85,75.65 v72.9,75.7 | v81.9,75.7 83.57,75.7 MIX1:IC3.10
  Top 0.406: MIX1:R1.1 MIX1:C1.1
  Bottom 0.381: v72.9,75.7 v81.9,75.7
MIX1:N$18
  Top 0.381: MIX1:IC3.6 MIX1:IC3.7 72,66.79 MIX1:C9.+
MIX1:N$19
  Top 0.508: MIX1:IC1.1 MIX1:IC1.2 97.16,79.54 97.5,79.2 97.5,76.1 97.13,75.73 MIX1:IC1.5
MIX1:N$20
  Top 0.381: MIX1:C8.- 90,61.34 MIX1:MIX.6 84,54.5 MIX1:R3.1
MIX1:N$21
  Top 0.381: MIX1:C8.+ 85.5,70.92 85.5,79 84.96,79.54 MIX1:IC3.13 MIX1:IC3.14
MIX1:N$22
  Top 0.381: MIX1:R7.1 91.83,78.67 | 91.83,78.67 91.85,78.7 MIX1:R8.1 | MIX1:IC1.6 94.54,74.46 93,76 93,77.5 91.83,78.67
MIX1:N$23
  Top 0.381: MIX1:C5.+ 96,73.09 MIX1:IC1.7 94.81,73.19 91.85,76.15 MIX1:R7.2
MIX1:N$25
  Top 0.381: MIX1:VOL.4 97.42,54.92 102,59.5 MIX1:C2.- 104.65,66.22 MIX1:R11.1
MIX1:N$28
  Top 0.381: MIX1:VOL.1 96,61.08 MIX1:C5.- 95,64.58 95,71 93,73 MIX1:R12.1
N$1
  Top 0.381: SPL1:IC1.8 SPL1:IC1.9 37.54,39.89 37.97,40.32 37.97,41.97 43.44,47.44 62.29,47.44 64.17,49.32 64.17,61.67 72.5,70 73,70 74,71 74,75 77.27,78.27 MIX1:IC3.3
N$2  (via drill 0.2)
  Top 0.254: v38.86,33.91 38.86,32.58 SPL1:IC1.7
  Top 0.381: SPL1:IC1.6 SPL1:IC1.7 | MIX1:IC3.5 77.23,75.73 76.5,75 76.5,72.5 72,68 71.5,68 65,61.5 65,49 57.61,41.61 49.89,33.89 v40.77,33.89
  Bottom 0.254: v40.77,33.89 38.88,33.89 v38.86,33.91
N$3  (via drill 0.2)
  Top 0.254: v47.24,63.06 41.72,57.53 28.97,57.53 28,58.5 28,62.5
  Top 0.381: EQ1:R10.1 28,62.5 28.5,62.5 29,63 EQ1:R9.1 | EQ1:R8.1 57.17,70.67 57.17,73.89 56.69,74.38 55.01,74.38 54.71,74.08 49.37,74.08 47.48,72.19 v47.23,72.19
  Top 0.406: MIX1:C1.2 67.75,71.6 EQ1:R8.1
  Top 0.508: v47.24,72.2 v47.23,72.19 EQ1:IC1.7
  Bottom 0.254: v47.24,72.2 v47.24,63.06
N$4  (via drill 0.2, 0.35)
  Top 0.254: 71.06,77.92 MIX1:C6.2 | v43.01,48.39 58.67,48.39 v59.44,49.15 61.91,49.15 EQ1:R14.1 | EQ1:R15.1 29.03,50.88 v29.03,51.82 28.1,52.74 28.1,57.4 26,59.5 EQ1:R16.1
  Top 0.406: EQ1:IC1.14 51.81,79.81 53.91,81.92 v59.45,81.92 63.59,81.92 67.58,77.92 71.06,77.92
  Bottom 0.254: v43.01,48.39 32.46,48.39 v29.03,51.82 | v59.45,81.92 59.44,81.9 v59.44,49.15
N$5
  Top 0.381: SPL1:IC1.13 SPL1:IC1.14 24.03,44.76 24.03,69.18 24.68,69.83 26.68,69.83 27.39,70.54 27.39,77.63 27.21,77.82 26.18,77.82 24.58,79.42 GAIN1:GAIN.6
N$6  (via drill 0.2)
  Top 0.381: SPL1:IC1.1 28,35.59 v28,35.62
  Top 0.508: SPL1:IC1.2 SPL1:IC1.1
  Bottom 0.381: v28,35.62 24.58,39.05 24.58,74.83 28.59,78.84 28.59,80.16 24.58,84.17 GAIN1:GAIN.3
N$7
  Top 0.254: SW1:U1.16 56.25,32.25 56,32.5 46,32.5 39.5,26 IN1:R2.2
  Top 0.508: IN1:C3.- 36.08,18.85 IN1:R2.2
N$8  (via drill 0.2)
  Top 0.381: GAIN1:R3.2 11.07,72.42 GAIN1:C1.- 11.18,77.22 11.18,81.79 12.95,83.57 14.22,83.57 16.26,85.6 16.26,86.11 18.8,88.65 v59.44,88.65 | v85.85,111.76 85.85,114.55 88.65,117.35 89.92,118.62 89.92,119.38 FV1-1:C1.-
  Bottom 0.381: v85.85,111.76 74.93,111.76 67.82,104.65 67.82,96.01 60.45,88.65 v59.44,88.65
N$9  (via drill 0.2)
  Top 0.381: GAIN1:R4.2 29,76.92 GAIN1:C2.- 32.44,80.52 v35.56,80.52 | v77.22,104.65 77.22,111.76 83.82,118.36 83.82,119.38 FV1-1:C2.-
  Bottom 0.381: v77.22,104.65 76.28,103.72 53.09,80.52 v35.56,80.52
N$10  (via drill 0.2)
  Top 0.381: v41.15,73.91 40.39,73.15 EQ1:C1.2 | v97.79,110.24 99.82,112.27 FV1-1:R7.2 100.08,112.27 101.09,113.28 101.09,114.3 100.08,115.32 100.08,117.09 FV1-1:C12.2
  Bottom 0.381: v41.15,73.91 48.01,73.91 75.95,101.85 89.41,101.85 v97.79,110.24
N$11  (via drill 0.2)
  Top 0.381: v59.94,79.25 55.88,79.25 EQ1:C7.2 | v106.93,109.98 108.97,112.01 FV1-1:R8.2
  Top 0.508: FV1-1:R8.2 109,112.26 109.93,113.19 109.93,114.51 109,115.44 FV1-1:C11.2
  Bottom 0.381: v106.93,109.98 106.93,103.63 91.69,88.39 91.69,86.36 90.17,84.84 72.84,84.84 67.25,79.25 v59.94,79.25
N$12
  Top 0.254: SW1:U1.8 57.75,28.25 58.5,27.5 58.5,27 58,26.5 44,26.5 41,23.5 41,5 40,4 39.35,4
  Top 0.508: IN1:C4.- 39.35,4 IN1:R4.2
N$13  (via drill 0.2, 0.35)
  Top 0.254: SW1:U1.4 55.1,29.25 v54.55,28.7
  Top 0.381: v62.39,27.39 93.89,27.39 94.15,27.65
  Top 0.508: OUT1:J2.TN 94.15,27.65 95.5,29 95.5,30.54 94.15,31.89 OUT1:J1.TN OUT1:J1.T
  Bottom 0.254: v54.55,28.7 55.42,27.83 57.99,27.83 58.43,27.39 v62.39,27.39
N$14  (via drill 0.35)
  Top 0.254: SW1:U1.12 61.25,30.75 v62.86,32.36 | v63.8,33.3 67.1,30 v71,30
  Bottom 0.254: v62.86,32.36 v63.8,33.3 | OUT1:J2.T 93.77,30 v71,30
N$15
  Top 0.508: PIC1:IC4.20 45.02,114.03 44.5,113.5
  Top 1.016: P1:C3.+ 31.57,109 40,109 44.5,113.5 | P1:C3.+ 28.73,107.85 P1:C5.1 25.2,108.65 P1:U$2.2 | P1:C3.+ 25.2,102.62 P1:U$1.1
N$17
  Top 0.254: SPL1:C1.2 31.15,27.85 31.5,27.5 39.96,27.5 45.34,32.88 56.38,32.88 56.75,32.51 SW1:U1.15
N$18  (via drill 0.35)
  Top 0.254: SW1:U1.7 57.25,27.75 v57.8,27.2 | v32,39.5 31.15,40.35 SPL1:C2.2
  Bottom 0.254: v57.8,27.2 57.8,26.98 57.49,26.67 44.83,26.67 v32,39.5
N$19  (via drill 0.35)
  Top 0.254: SW1:U1.11 62.25,30.25 v63.61,31.61
  Top 0.381: MIX1:VOL.5 98.14,54.92 96.55,53.33 91.83,53.33 v73,34.5
  Bottom 0.381: v73,34.5 70.11,31.61 v63.61,31.61
N$20  (via drill 0.2, 0.35)
  Top 0.254: SW1:U1.3 54.85,29.75 v54.55,29.45
  Top 0.381: MIX1:VOL.2 96.51,56.51 93.52,56.51 71.64,34.63 71.64,29.73 70.23,28.32 v61.46,28.32
  Bottom 0.254: v61.46,28.32 55.68,28.32 v54.55,29.45
N$22  (via drill 0.2)
  Top 0.381: v82.3,102.62 82.3,102.36 90.68,93.98 92.71,93.98 FV1-1:U1.13 | PIC1:IC1.26 69.58,106.44 v70.1,105.92
  Bottom 0.381: v82.3,102.62 80.26,102.62 76.96,105.92 v70.1,105.92
N$23  (via drill 0.2)
  Top 0.381: v69.34,109.73 68.83,109.22 68.83,108.97 68.33,108.46 PIC1:IC1.25 | v91.69,112.01 100.33,103.38 100.33,97.79 101.6,96.52 102.11,96.52 FV1-1:U1.18
  Bottom 0.381: v69.34,109.73 72.14,109.73 74.93,112.52 91.19,112.52 v91.69,112.01
N$25  (via drill 0.2)
  Top 0.381: v68.07,109.73 67.56,109.22 67.56,108.97 67.06,108.46 PIC1:IC1.24 | v94.23,108.2 99.82,102.62 99.82,97.03 101.6,95.25 102.11,95.25 FV1-1:U1.17
  Bottom 0.381: v68.07,109.73 71.37,113.03 91.69,113.03 94.23,110.49 v94.23,108.2
N$26  (via drill 0.2)
  Top 0.381: v66.55,109.47 66.29,109.22 66.29,108.97 65.79,108.46 PIC1:IC1.23 | v98.81,102.36 98.81,96.77 101.6,93.98 102.11,93.98 FV1-1:U1.16
  Bottom 0.381: v66.55,109.47 70.61,113.54 95.5,113.54 98.81,110.24 v98.81,102.36
N$27
  Top 0.381: 60.2,103.63 60.2,104.39 58.17,106.43 58.17,108.2 PIC1:IC1.17 | 60.2,103.63 60.2,98.55 PIC1:R3.1 | FV1-1:U1.14 92.71,92.71 89.92,92.71 81.28,101.35 80.77,101.35 PIC1:IC3.6 80.52,101.35 79.76,101.35 78.99,100.58 78.99,99.31 | 78.99,99.31 78.99,94.23 79.76,93.47 80.52,93.47 PIC1:IC2.6 | 60.2,103.63 69.85,103.63 70.87,102.62 70.87,100.59 72.14,99.31 78.99,99.31
N$28
  Top 0.381: 83.82,91.95 80.77,91.95 PIC1:IC2.5 80.52,91.95 80.01,91.44 74.17,91.44 70.36,95.25 65.02,95.25 63.75,93.98 61.21,93.98 60.2,95 PIC1:R4.2 59.94,95.25 59.94,97.03 57.9,99.07 57.9,103.6 56.88,104.62 PIC1:IC1.16 | 83.82,91.95 93.73,91.95 94.23,92.46 102.11,92.46 FV1-1:U1.15 | 83.82,91.95 83.82,96.01 80.77,99.06 80.77,100.08 PIC1:IC3.5
P1:N$27
  Bottom 1.016: P1:J1.1 17.59,124.4 P1:D1.A
PIC1:!MCLR
  Top 0.381: 72.9,117.85 72.9,102.87 72.14,102.11 PIC1:SV1.1
  Top 0.508: PIC1:IC1.1 72.19,117.85 72.9,117.85 PIC1:R1.2
PIC1:ICSPCLK  (via drill 0.2)
  Top 0.381: v64.52,105.16 70.36,105.16 70.87,105.66 70.87,108.2 PIC1:IC1.27
  Bottom 0.381: v64.52,105.16 64.26,105.16 61.98,102.87 61.98,102.11 PIC1:SV1.5
PIC1:ICSPDAT  (via drill 0.2)
  Top 0.381: v64.52,104.39 70.36,104.39 71.88,105.92 71.88,108.2 PIC1:IC1.28
  Bottom 0.381: v64.52,104.39 64.52,102.11 PIC1:SV1.4
PIC1:INT_EXT
  Top 0.381: PIC1:IC1.9 61.33,117.15 61.33,116.8 55.04,110.51 50.29,110.51 43.47,103.69 42.04,103.69 41.46,103.1 41.46,100.08 32.37,91 17,91 PIC1:SW_1.2
PIC1:LCD_D4
  Top 0.508: PIC1:IC1.4 68.31,118.31 71,121 73.6,121 PIC1:U$2.11
PIC1:LCD_D5
  Top 0.508: PIC1:U$2.12 72.06,122 70.5,122 67.04,118.54 PIC1:IC1.5
PIC1:LCD_D6
  Top 0.508: PIC1:IC1.6 65.77,118.77 70.5,123.5 PIC1:U$2.13
PIC1:LCD_D7
  Top 0.508: PIC1:IC1.7 64.5,119.52 PIC1:U$2.14
PIC1:LCD_EN
  Top 0.508: PIC1:IC1.3 69.58,118.58 71.14,120.14 80.24,120.14 81.74,121.64 86.94,121.64 PIC1:U$2.6
PIC1:LCD_RS
  Top 0.508: PIC1:U$2.4 91.38,121 82,121 80.5,119.5 72.13,119.5 70.85,118.22 PIC1:IC1.2
PIC1:MIDI_RX  (via drill 0.2)
  Top 0.381: v64.26,109.47 64.26,108.46 PIC1:IC1.22 | v50.04,124.46 41.91,124.46 41.71,124.66 PIC1:J1.2
  Bottom 0.381: v64.26,109.47 64.26,110.24 v50.04,124.46
PIC1:MIDI_TX  (via drill 0.2)
  Top 0.381: v62.99,112.52 62.99,108.46 PIC1:IC1.21 | v50.8,124.71 47.5,128.02 40.64,128.02 35.81,132.84 31.52,132.84 PIC1:J1.3
  Bottom 0.381: v62.99,112.52 56.13,119.38 55.88,119.38 50.8,124.46 v50.8,124.71
PIC1:N$1
  Top 0.381: PIC1:JP1.2 45,104 51,110 58.84,110 59.42,109.42 PIC1:IC1.18
PIC1:N$2
  Top 0.508: PIC1:JP2.1 42.5,101.96 PIC1:JP1.1
PIC1:N$3
  Top 0.508: PIC1:C3.1 48.92,112.08 PIC1:IC4.17
PIC1:N$4
  Top 0.254: PIC1:IC4.19 46.48,113.35 45.91,113.35 45.53,112.97 45.53,110.49 46.67,109.35 48.2,109.35 49.91,111.06 49.91,115.25 49.15,116.01 PIC1:R12.1
  Top 0.508: PIC1:R13.2 49,119.44 49.93,118.51 49.93,117.19 49,116.26 PIC1:R12.1
PIC1:N$5
  Top 0.381: 47.54,97.39 PIC1:R2.2
  Top 0.508: PIC1:JP1.3 47.54,97.39
PIC1:N$6
  Top 0.381: 50.49,95.65 PIC1:LED1.A
  Top 0.508: PIC1:R2.1 50.49,95.65
PIC1:N$7
  Top 0.508: PIC1:X2.1 51.6,124.45 PIC1:R13.1
PIC1:N$9
  Top 0.508: PIC1:S1.3 12,100.53 PIC1:R6.1 9.7,102.15 PIC1:R5.2
PIC1:N$10
  Top 0.508: PIC1:S1.4 16,99.03 PIC1:R7.1 13.7,102.15 PIC1:R6.2
PIC1:N$11
  Top 0.508: PIC1:S1.5 20,99.53 PIC1:R8.1 17.7,102.15 PIC1:R7.2
PIC1:N$12
  Top 0.508: PIC1:S1.6 20,115.83 PIC1:R9.1 20,113.74 20.93,112.81 20.93,111.49 20,110.56 PIC1:R8.2
PIC1:N$13
  Top 0.508: PIC1:S1.7 16,116.33 PIC1:R10.1 18.3,113.85 PIC1:R9.2
PIC1:N$14
  Top 0.508: PIC1:S1.8 12,114.83 PIC1:R11.1 14.3,113.85 PIC1:R10.2
PIC1:N$16
  Bottom 0.508: PIC1:POT1.2 98.46,121.46 PIC1:U$2.3
PIC1:P_SEL  (via drill 0.2)
  Top 0.254: v54.67,111.44 60.58,117.35 60.58,117.73 PIC1:IC1.10
  Bottom 0.254: v54.67,111.44 54.67,110.08 52.61,108.01 46.67,108.01 36.77,117.92 28.38,117.92 9.14,98.68 PIC1:S1.1
PIC1:PWM3
  Top 0.508: PIC1:IC1.11 59.42,119.52 PIC1:U$2.16
PIC1:PWM4
  Top 0.508: PIC1:IC1.12 58.15,120.79 PIC1:U$2.17
PIC1:PWM5
  Top 0.508: PIC1:IC1.13 56.88,122.06 PIC1:U$2.18
PIC1:USB_DM  (via drill 0.35)
  Top 0.508: PIC1:X2.2 v50.8,128.5 | v49,111 47.9,111 47.47,111.42 PIC1:IC4.16
  Bottom 0.508: v50.8,128.5 50.8,127.3 49,125.5 v49,111
PIC1:USB_DP  (via drill 0.35)
  Top 0.508: PIC1:X2.3 v50,128 | v48,110 47.23,110.78 PIC1:IC4.15
  Bottom 0.508: v50,128 48,126 v48,110
PIC1:USB_RX
  Top 0.254: PIC1:IC4.1 39.43,119.25 45.34,119.25 47.05,120.97 52.39,120.97 55.44,117.92 PIC1:IC1.14
PIC1:USB_TX  (via drill 0.2)
  Top 0.254: v40.96,116.2 40.58,116.59 39.43,116.59 PIC1:IC4.5 | v52.22,108.58 55.24,108.58 PIC1:IC1.15
  Bottom 0.254: v40.96,116.2 48.58,108.58 v52.22,108.58
SPL1:N$3
  Top 0.381: SPL1:IC1.12 33.73,40 | 33.73,40 33.73,40.12 SPL1:C2.1 | SPL1:R2.1 35,41 | 35,41 34.73,41 33.73,40 | SPL1:IC1.5 36.27,35.55 36.89,36.17 36.89,39.11 35,41
SPL1:N$5
  Top 0.381: 33.73,29.88 SPL1:IC1.3 33.73,33.73 36.27,36.27 SPL1:IC1.10 | SPL1:R1.1 34.61,29 33.73,29.88 | SPL1:C1.1 33.73,29.88
SW1:CB  (via drill 0.2, 0.35)
  Top 0.254: SW1:U1.2 54.6,30.25 v54.55,30.2 | v65.66,29.56 v60.06,29.56 60.04,29.56 59.85,29.75 SW1:U1.10
  Bottom 0.254: v65.66,29.56 66.7,28.52 71.22,28.52 76,23.73 76,12.19 SW1:SW_1.A2 | v60.06,29.56 55.19,29.56 v54.55,30.2
SW1:N$1
  Top 0.508: SW1:SW_1.B2 80.46,17.81 SW1:LED1.K
SW1:N$5
  Top 0.508: SW1:LED1.A 82,9.15 SW1:R1.2
SW1:NC_12
  Top 0.254: SW1:U1.1 54.25,30.75 54,30.5 54,28.5 54.5,28 56,28 56.25,28.25 SW1:U1.5
SW1:NC_34
  Top 0.254: SW1:U1.9 59.35,29.25 59.7,28.9 65.83,28.9 66.24,29.32 66.24,29.8 62.84,33.2 59,33.2 57.75,31.95 SW1:U1.13